# Altium schematic sheet Alim.SchDoc
size A
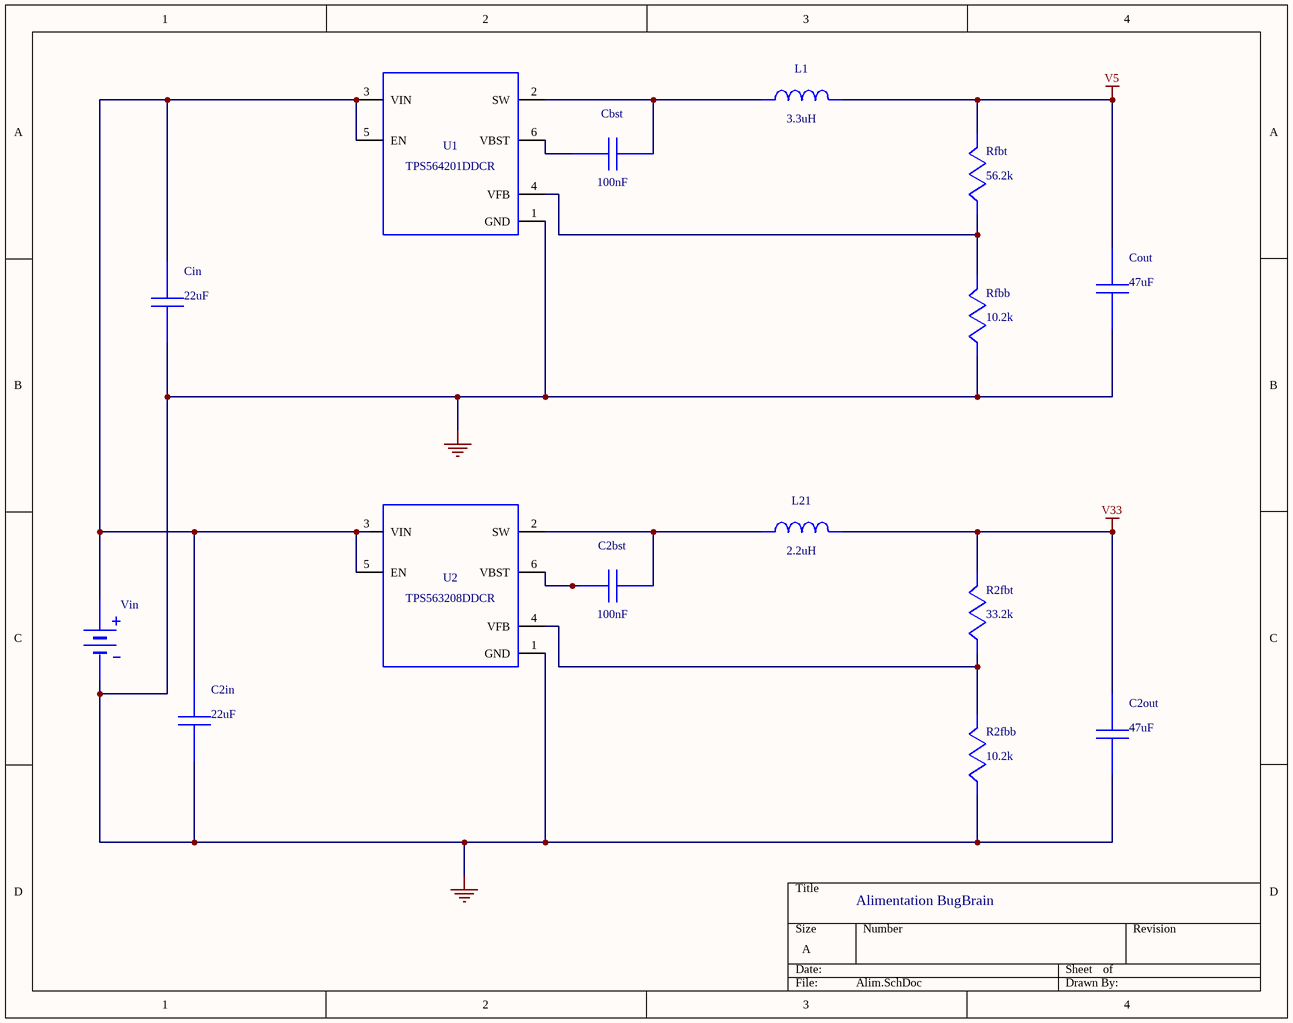
[diagram p0: Alim.SchDoc]

## Parts
C2bst  value 100nF  (hidden comment: C0805C104K3RACTU)
C2in  value 22uF  (hidden comment: GRM32ER61E226KE15L)
C2out  value 47uF  (hidden comment: C3216X5R1E476M160AC)
Cbst  value 100nF  (hidden comment: C0805C104K3RACTU)
Cin  value 22uF  (hidden comment: GRM32ER61E226KE15L)
Cout  value 47uF  (hidden comment: C3216X5R1E476M160AC)
L1  value 3.3uH  (hidden comment: VLP8040T-3R3N)
L21  value 2.2uH  (hidden comment: VLP8040T-2R2N)
R2fbb  value 10.2k  (hidden comment: ERJ-6ENF1022V)
R2fbt  value 33.2k  (hidden comment: CRCW040233K2FKED)
Rfbb  value 10.2k  (hidden comment: ERJ-6ENF1022V)
Rfbt  value 56.2k  (hidden comment: CRCW040256K2FKED)
U1  TPS564201DDCR
U2  TPS563208DDCR
Vin  WB_BATTERY  (value not drawn)

## Nets
0: C2in.2 C2out.2 Cin.2 Cout.2 R2fbb.2 Rfbb.2 U1.1(GND) U2.1(GND) Vin.2(-)
V5: Cout.1 L1.2 Rfbt.1
V33: C2out.1 L21.2 R2fbt.1
NetC2bst_1: C2bst.1 L21.1 U2.2(SW)
NetC2bst_2: C2bst.2 U2.6(VBST)
NetC2in_1: C2in.1 Cin.1 U1.3(VIN) U1.5(EN) U2.3(VIN) U2.5(EN) Vin.1(+)
NetCbst_1: Cbst.1 L1.1 U1.2(SW)
NetCbst_2: Cbst.2 U1.6(VBST)
NetR2fbb_1: R2fbb.1 R2fbt.2 U2.4(VFB)
NetRfbb_1: Rfbb.1 Rfbt.2 U1.4(VFB)

## Notes on the sheet
- Alimentation BugBrain

## Library data of the parts
C2bst Cbst = C0805C104K3RACTU: Manufacturer Name: Kemet; PackageReference: C0805C104K3RACTU; Manufacturer Part Number: C0805C104K3RACTU
C2in Cin = GRM32ER61E226KE15L: GRM32ER61E226KE1; Manufacturer Name: MuRata; PackageReference: GRM32ER61E226KE15L; Manufacturer Part Number: GRM32ER61E226KE15L
C2out Cout = C3216X5R1E476M160AC: C3216X5R1E476M16; Manufacturer Name: TDK; PackageReference: C3216X5R1E476M160AC; Manufacturer Part Number: C3216X5R1E476M160AC
L1 = VLP8040T-3R3N: Unknown; Manufacturer Name: TDK; PackageReference: VLP8040T-3R3N; Manufacturer Part Number: VLP8040T-3R3N
L21 = VLP8040T-2R2N: Unknown; Manufacturer Name: TDK; PackageReference: VLP8040T-2R2N; Manufacturer Part Number: VLP8040T-2R2N
R2fbb Rfbb = ERJ-6ENF1022V: Manufacturer Name: Panasonic; PackageReference: ERJ-6ENF1022V; Manufacturer Part Number: ERJ-6ENF1022V
R2fbt = CRCW040233K2FKED: Manufacturer Name: Vishay-Dale; PackageReference: CRCW040233K2FKED; Manufacturer Part Number: CRCW040233K2FKED
Rfbt = CRCW040256K2FKED: Manufacturer Name: Vishay-Dale; PackageReference: CRCW040256K2FKED; Manufacturer Part Number: CRCW040256K2FKED
U1 = TPS564201DDCR: TPS564201DDCR - 5V; Manufacturer Name: Texas Instruments; PackageReference: TPS564201DDCR; Manufacturer Part Number: TPS564201DDCR; Value: N/A
U2 = TPS563208DDCR: TPS563208DDCR 3.3V; Manufacturer Name: Texas Instruments; PackageReference: TPS563208DDCR; Manufacturer Part Number: TPS563208DDCR; Value: N/A
Vin = WB_BATTERY: PackageReference: WB_BATTERY; Manufacturer Part Number: WB_BATTERY; Manufacturer Name: WB_BATTERY; Value: N/A